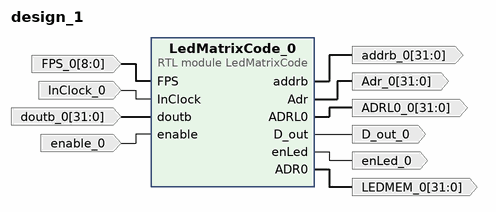
[diagram p0: block diagram of the top level]
# Vivado block design design_1, xc7z007sclg225-1, Vivado 2021.1
create_bd_design design_1

create_bd_port -dir I enable_0
create_bd_port -dir I -from 8 -to 0 FPS_0
create_bd_port -dir I -from 31 -to 0 doutb_0
create_bd_port -dir O D_out_0
create_bd_port -dir O -from 31 -to 0 Adr_0
create_bd_port -dir O -from 31 -to 0 LEDMEM_0
create_bd_port -dir I InClock_0
create_bd_port -dir O enLed_0
create_bd_port -dir O -from 31 -to 0 addrb_0
create_bd_port -dir O -from 31 -to 0 ADRL0_0

create_bd_cell -type module -reference LedMatrixCode LedMatrixCode_0

# ---- connections ----

connect_bd_net -net FPS_0_1 [get_bd_ports FPS_0] [get_bd_pins LedMatrixCode_0/FPS]
connect_bd_net -net InClock_0_1 [get_bd_ports InClock_0] [get_bd_pins LedMatrixCode_0/InClock]
connect_bd_net [get_bd_pins LedMatrixCode_0/ADRL0] [get_bd_ports ADRL0_0]
connect_bd_net [get_bd_pins LedMatrixCode_0/Adr] [get_bd_ports Adr_0]
connect_bd_net [get_bd_pins LedMatrixCode_0/D_out] [get_bd_ports D_out_0]
connect_bd_net -net LedMatrixCode_0_LEDMEM [get_bd_pins LedMatrixCode_0/ADR0] [get_bd_ports LEDMEM_0]
connect_bd_net [get_bd_pins LedMatrixCode_0/addrb] [get_bd_ports addrb_0]
connect_bd_net [get_bd_pins LedMatrixCode_0/enLed] [get_bd_ports enLed_0]
connect_bd_net -net doutb_0_1 [get_bd_ports doutb_0] [get_bd_pins LedMatrixCode_0/doutb]
connect_bd_net -net enable_0_1 [get_bd_ports enable_0] [get_bd_pins LedMatrixCode_0/enable]

validate_bd_design
save_bd_design
